# EAGLE design AVR-ISP_pogo-plug_1.27mm (EAGLE 8.5.0)
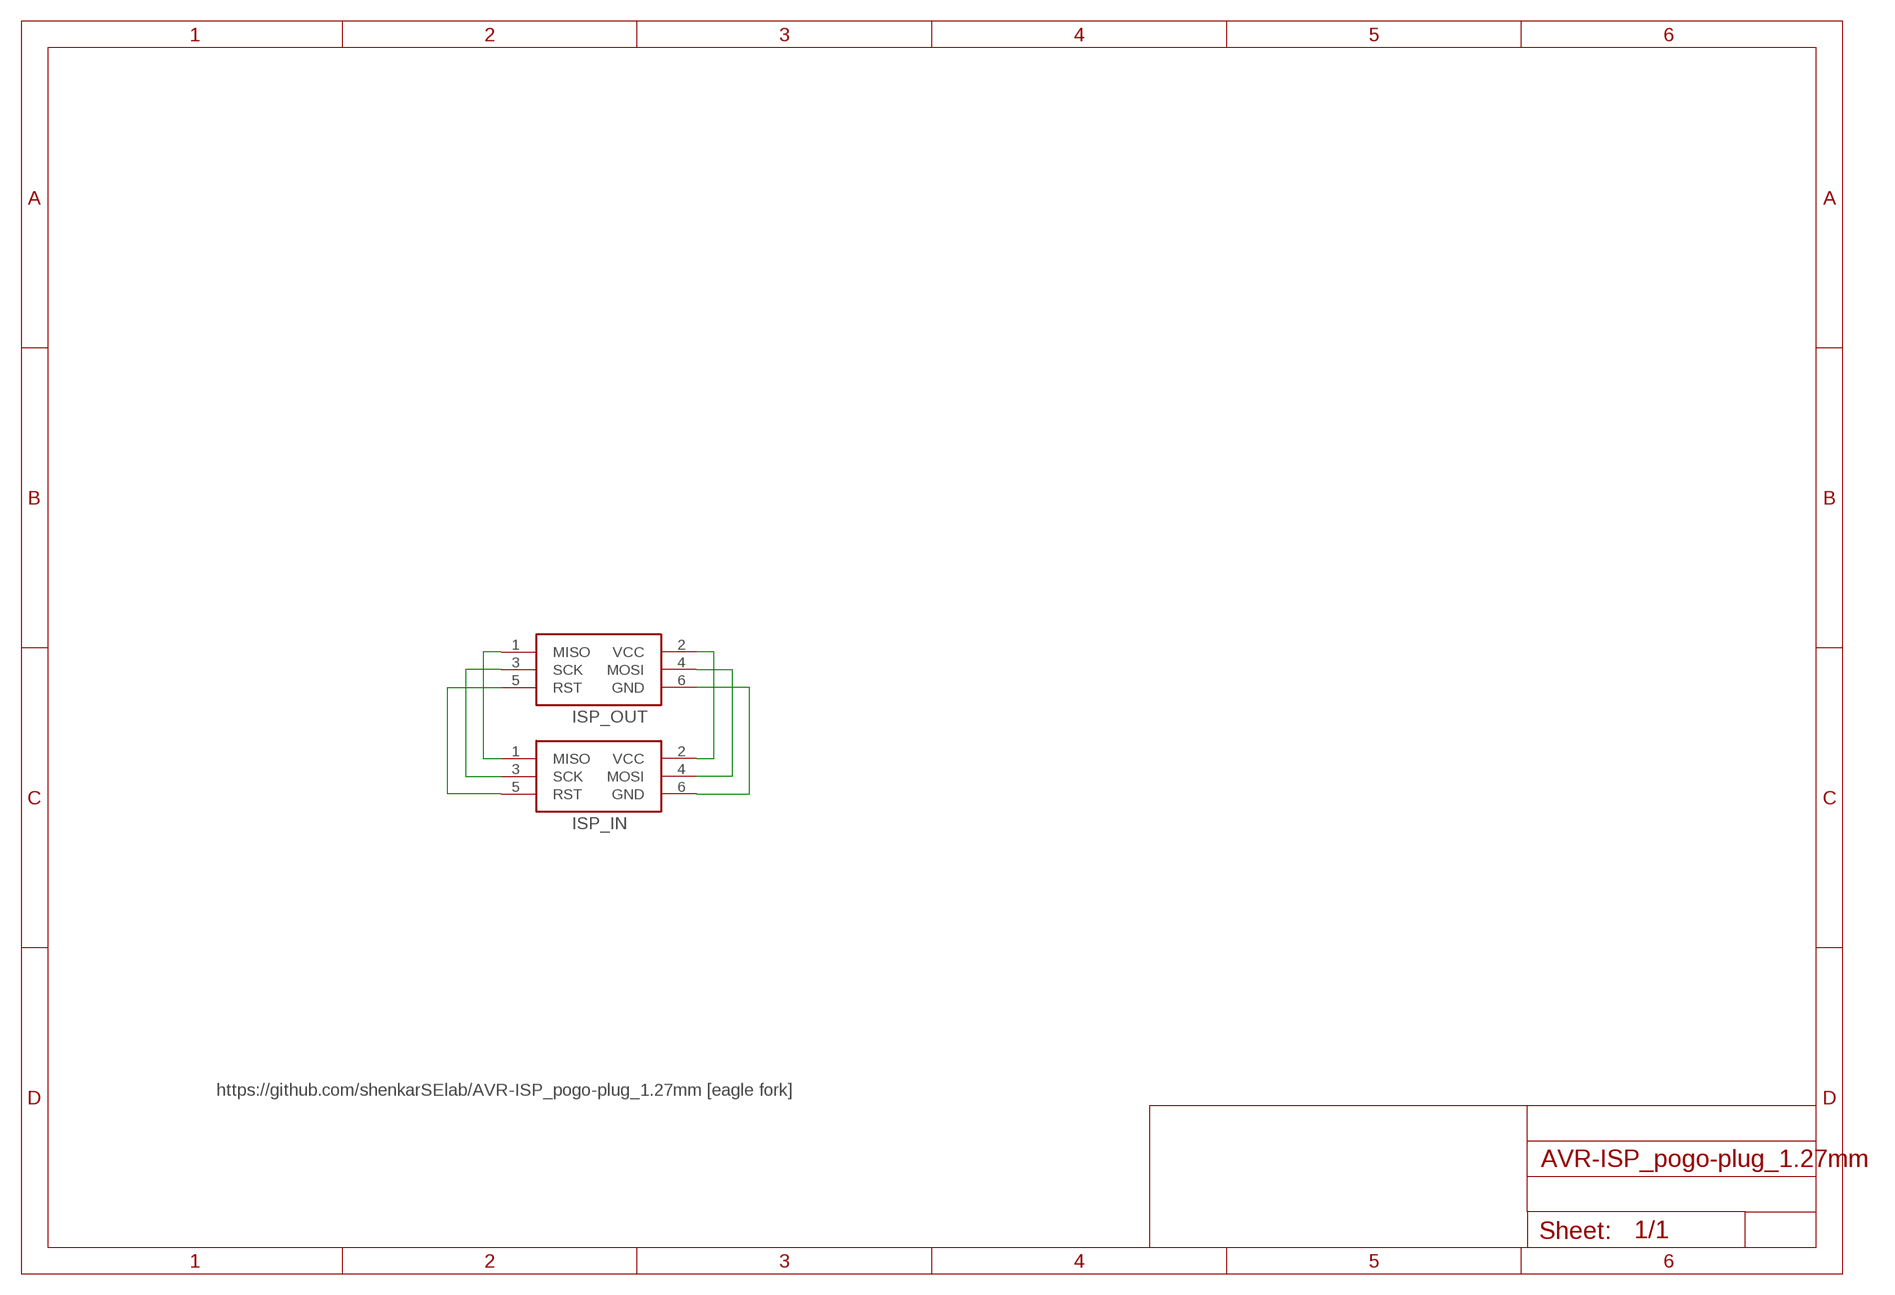
[diagram p0: schematic, sheet 1]

## Parts
ISP_IN  AVRISP-6  [AVRISP]
ISP_OUT  AVRISPPOGOPINS  [POGO-50MIL-6PADS]

## Nets
N$1: ISP_IN.2(VCC) ISP_OUT.2(VCC)
N$2: ISP_IN.4(MOSI) ISP_OUT.4(MOSI)
N$3: ISP_IN.6(GND) ISP_OUT.6(GND)
N$4: ISP_IN.1(MISO) ISP_OUT.1(MISO)
N$5: ISP_IN.3(SCK) ISP_OUT.3(SCK)
N$6: ISP_IN.5(RST) ISP_OUT.5(RST)

## Notes on the sheet
- https://github.com/shenkarSElab/AVR-ISP_pogo-plug_1.27mm [eagle fork]

## Library data of the parts
ISP_IN = TinyTony_ShenzenReady:AVRISP: AVR ISP HEADER Standard 6 pin header for AVR programming; SPICEPREFIX: X
ISP_OUT = TinyTony_ShenzenReady:AVRISP: AVR ISP HEADER Standard 6 pin header for AVR programming

## Board
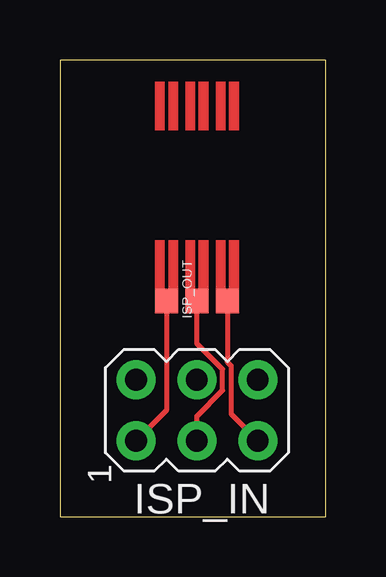
[diagram p1: board, top side]
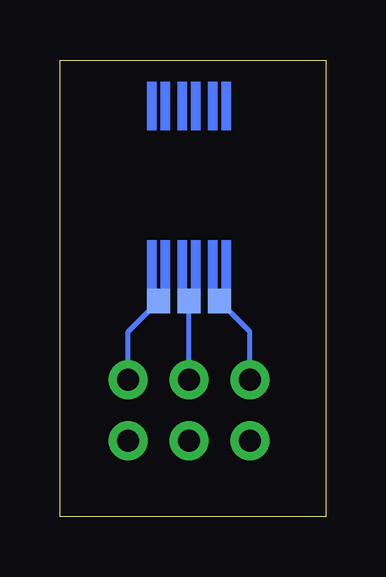
[diagram p2: board, bottom side, seen from below]

Size 11.1 x 19.04 mm. Coordinates in mm from the lower left corner, seen from the top.
Outline: 0,0 11.1,0 11.1,19.04 0,19.04 0,0
Copper layers (1*16): Top 0.035mm / dielectric 1.5mm / Bottom 0.035mm
Design rules "default": minimum track width 6mil, minimum drill 0.35mm, track to track 6mil, track to pad 6mil, pad to pad 6mil, via to via 6mil, smd to smd 6mil, copper to edge 40mil, drill to drill 6mil, minimum pad ring 10mil, minimum via ring 8mil, stop-mask expansion 4mil, vias tented up to drill 0mil, thermal gap 10mil

### Footprints (pad centres in the part's own frame; a part is rotated, then mirrored left to right if it is on the bottom)
AVRISP = drill 0.9 pad 1.626: 1 -1.27,2.54; 2 1.27,2.54; 3 -1.27,0; 4 1.27,0; 5 -1.27,-2.54; 6 1.27,-2.54
POGO-50MIL-6PADS = smd 0.965 x 1.016: 1 -1.27,0.508; 3 0,0.508; 5 1.27,0.508 | smd 0.965 x 1.016 bottom: 2 -1.27,0.508; 4 0,0.508; 6 1.27,0.508

### Placement (x,y rotation side)
ISP_IN  5.71,4.45 90 top
ISP_OUT  5.71,8.48 0 top

### Tracks (layer width: path | path; a pad name or v marks a point on that pad's centre or on a via)
N$1
  Bottom 0.203: ISP_IN.2 3.17,7.72 ISP_OUT.2
N$2
  Bottom 0.203: ISP_IN.4 ISP_OUT.4
N$3
  Bottom 0.203: ISP_IN.6 8.26,7.72 ISP_OUT.6
N$4
  Top 0.203: ISP_OUT.1 4.45,4.45 ISP_IN.1
N$5
  Top 0.203: ISP_IN.3 5.71,4.21 6.78,5.27 6.78,6.16 5.71,7.22 ISP_OUT.3
N$6
  Top 0.203: ISP_OUT.5 6.99,6.46 7.14,6.3 7.14,4.29 ISP_IN.5